# Altium schematic sheet TPS62932DRLR1_TPS62932DRLR.schdoc
size 124 x 99 mm
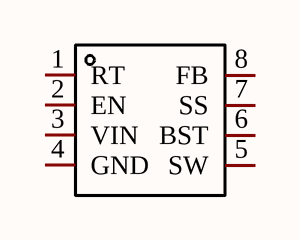
[diagram p0: TPS62932DRLR1_TPS62932DRLR.schdoc]

## Parts
U?  TPS62932DRLR  [SMD-8_L2.1-W1.2-P0.50-LS1.6-BL]  (value not drawn)

## Nets

Not connected (* = marked no-connect by the designer): U? 1(RT) 2(EN) 3(VIN) 4(GND) 5(SW) 6(BST) 7(SS) 8(FB)

## Library data of the parts
U? = TPS62932DRLR: Manufacturer: TI(德州仪器); Add into BOM: yes; Function: 降压型; Output Type: 可调; Input Voltage: 3.8V~30V; Output Voltage: 800mV~22V; Output Current (Max): 2A; Switching Frequency: 2.2MHz; Synchronous Rectification: 是; Number of Outputs: 1; Topology: 降压式; Switch tube (built-in/external): 内置; Symbol: TPS62932DRLR; Device: TPS62932DRLR; LCSC Part Name: TPS62932DRLR; Supplier Part: C3032935; Manufacturer Part: TPS62932DRLR; Supplier Footprint: SOT-5x3-8; JLCPCB Part Class: Extended Part; Datasheet: https://www.ti.com/cn/lit/gpn/tps62933; Supplier: LCSC; Convert to PCB: yes; Operating Temperature: -40℃~+150℃@(TJ)